# Altium schematic sheet Converter.SchDoc
size Tabloid
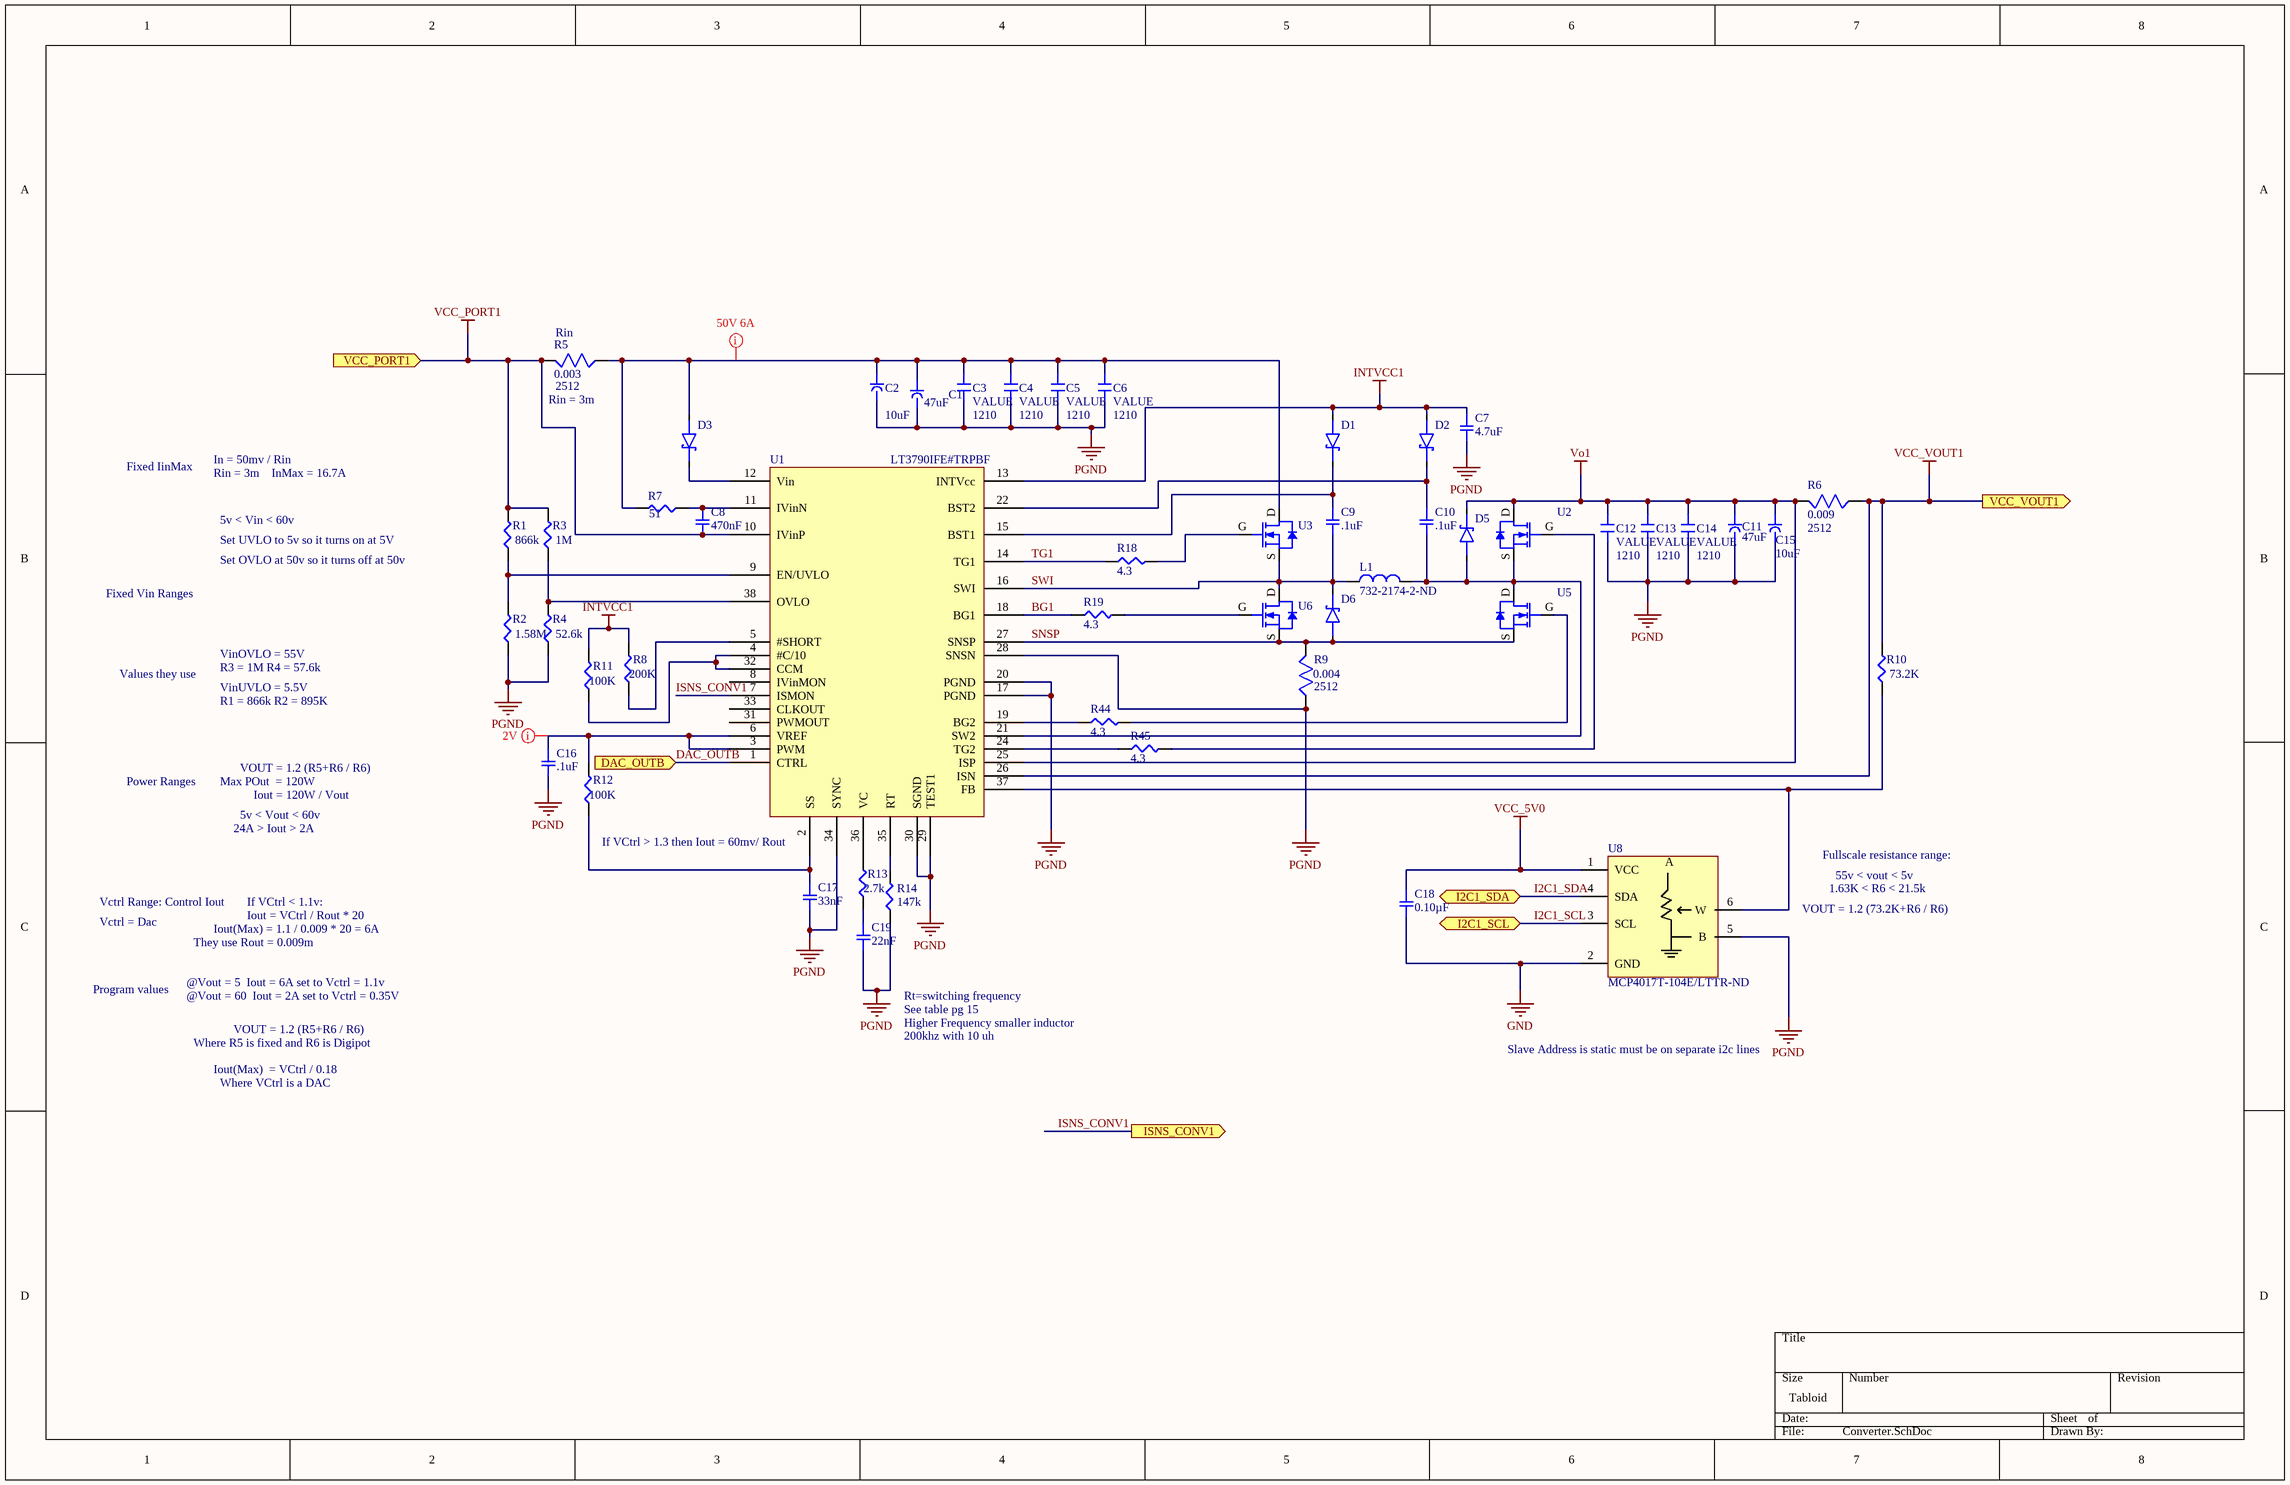
[diagram p0: Converter.SchDoc]

## Parts
C1  10-EEE-FN1K470UVTR-ND  [EEE-FN1K470UV]  (value not drawn)
C2  value 10uF  [panasonic d8]  (hidden comment: EEE-FN1K100XL)
C3  VALUE  Size: 1210  [1210 cap]
C4  VALUE  Size: 1210  [1210 cap]
C5  VALUE  Size: 1210  [1210 cap]
C6  VALUE  Size: 1210  [1210 cap]
C7  4.7uF  [SMD-0603C]
C8  470nF  [SMD-0603C]
C9  .1uF  [SMD-0603C]
C10  .1uF  [SMD-0603C]
C11  10-EEE-FN1K470UVTR-ND  [EEE-FN1K470UV]  (value not drawn)
C12  VALUE  Size: 1210  [1210 cap]
C13  VALUE  Size: 1210  [1210 cap]
C14  VALUE  Size: 1210  [1210 cap]
C15  value 10uF  [panasonic d8]  (hidden comment: EEE-FN1K100XL)
C16  .1uF  [SMD-0603C]
C17  33nF  [SMD-0603C]
C18  0.10µF  [SMD-0603C]
C19  22nF  [SMD-0603C]
D1  BAT46WJ,115  [SOD323F]  (value not drawn)
D2  BAT46WJ,115  [SOD323F]  (value not drawn)
D3  SK58L-TPMSTR-ND  [SMC(DO-214AB)]  (value not drawn)
D5  SK58L-TPMSTR-ND  [SMC(DO-214AB)]  (value not drawn)
D6  SK58L-TPMSTR-ND  [SMC(DO-214AB)]  (value not drawn)
L1  732-2174-2-ND  [Inductor]
R1  866k  [SMD-0603-RES]
R2  1.58M  [SMD-0603-RES]
R3  1M  [SMD-0603-RES]
R4  52.6k  [SMD-0603-RES]
R5  0.003  [2512]
R6  0.009  [2512]
R7  51  [SMD-0603-RES]
R8  200K  [SMD-0603-RES]
R9  0.004  [2512]
R10  73.2K  [SMD-0603-RES]
R11  100K  [SMD-0603-RES]
R12  100K  [SMD-0603-RES]
R13  2.7k  [SMD-0603-RES]
R14  147k  [SMD-0603-RES]
R18  4.3  [SMD-0603-RES]
R19  4.3  [SMD-0603-RES]
R44  4.3  [SMD-0603-RES]
R45  4.3  [SMD-0603-RES]
U1  LT3790IFE#TRPBF  [TSSOP-38-GNDPAD]
U2  SQJA80EP-T1_GE3TR-ND  [PowerPAK® SO-8L SINGLE]  (value not drawn)
U3  SQJA80EP-T1_GE3TR-ND  [PowerPAK® SO-8L SINGLE]  (value not drawn)
U5  SQJA80EP-T1_GE3TR-ND  [PowerPAK® SO-8L SINGLE]  (value not drawn)
U6  SQJA80EP-T1_GE3TR-ND  [PowerPAK® SO-8L SINGLE]  (value not drawn)
U8  MCP4017T-104E/LTTR-ND  [SC70]

## Ports
DAC_OUTB (in), I2C1_SCL (bidir), I2C1_SDA (bidir), ISNS_CONV1 (out), VCC_PORT1 (in), VCC_VOUT1 (out)

## Nets
GND: C18.2 U8.2(GND)
INTVCC1: C7.1 D1.2 D2.2 R8.2 R11.2 U1.13(INTVcc)
PGND: C1.1 C2.2 C3.2 C4.2 C5.2 C6.2 C7.2 C11.1 C12.2 C13.2 C14.2 C15.2 C16.2 C17.2 C19.2 R2.1 R4.1 R9.1 R14.1 U1.17(PGND) U1.20(PGND) U1.28(SNSN) U1.29(TEST1) U1.30(SGND) U1.34(SYNC) U8.5(B)
VCC_5V0: C18.1 U8.1(VCC)
VCC_PORT1: C8.2 R1.2 R3.2 R5.2 U1.10(IVinP) ; port VCC_PORT1
VCC_VOUT1: R6.1 R10.2 U1.26(ISN) ; port VCC_VOUT1
Vo1: C11.2 C12.1 C13.1 C14.1 C15.1 D5.1 R6.2 U1.25(ISP) U2.D(DRAIN)
BG1: R19.1 U1.18(BG1)
DAC_OUTB: U1.1(CTRL) ; port DAC_OUTB
I2C1_SCL: U8.3(SCL) ; port I2C1_SCL
I2C1_SDA: U8.4(SDA) ; port I2C1_SDA
ISNS_CONV1: U1.7(ISMON) ; port ISNS_CONV1
SNSP: D6.2 R9.2 U1.27(SNSP) U5.S(SOURCE) U6.S(SOURCE)
SWI: C9.2 D6.1 L1.1 U1.16(SWI) U3.S(SOURCE) U6.D(DRAIN)
TG1: R18.1 U1.14(TG1)
NetC1_2: C1.2 C2.1 C3.1 C4.1 C5.1 C6.1 D3.2 R5.1 R7.2 U3.D(DRAIN)
NetC8_1: C8.1 R7.1 U1.11(IVinN)
NetC9_1: C9.1 D1.1 U1.15(BST1)
NetC10_1: C10.1 D2.1 U1.22(BST2)
NetC10_2: C10.2 D5.2 L1.2 U1.21(SW2) U2.S(SOURCE) U5.D(DRAIN)
NetC16_1: C16.1 R12.2 U1.3(PWM) U1.6(VREF)
NetC17_1: C17.1 R12.1 U1.2(SS)
NetC19_1: C19.1 R13.1
NetD3_1: D3.1 U1.12(Vin)
NetR1_1: R1.1 R2.2 U1.9(EN/UVLO)
NetR3_1: R3.1 R4.2 U1.38(OVLO)
NetR8_1: R8.1 U1.5(#SHORT)
NetR10_1: R10.1 U1.37(FB) U8.6(W)
NetR11_1: R11.1 U1.4(#C/10) U1.32(CCM)
NetR13_2: R13.2 U1.36(VC)
NetR14_2: R14.2 U1.35(RT)
NetR18_2: R18.2 U3.G(GATE)
NetR19_2: R19.2 U6.G(GATE)
NetR44_1: R44.1 U1.19(BG2)
NetR44_2: R44.2 U5.G(GATE)
NetR45_1: R45.1 U1.24(TG2)
NetR45_2: R45.2 U2.G(GATE)

Not connected (* = marked no-connect by the designer): U1 8(IVinMON) 31(PWMOUT) 33(CLKOUT)

## Layout directives
mark named 2V: NetC16_1
mark named 50V 6A: NetC1_2

## Notes on the sheet
- (near R5) Rin
- (near R5) Rin = 3m
- Fixed IinMax
- Rin = 3m    InMax = 16.7A
- In = 50mv / Rin
- Set UVLO to 5v so it turns on at 5V
- Set OVLO at 50v so it turns off at 50v
- 5v < Vin < 60v
- Fixed Vin Ranges
- Values they use
- VinOVLO = 55V
- R3 = 1M R4 = 57.6k
- VinUVLO = 5.5V
- R1 = 866k R2 = 895K
- Power Ranges
- Max POut  = 120W
- 24A > Iout > 2A
- 5v < Vout < 60v
- VOUT = 1.2 (R5+R6 / R6)
- Iout = 120W / Vout
- If VCtrl > 1.3 then Iout = 60mv/ Rout
- Fullscale resistance range:
- 1.63K < R6 < 21.5k
- 55v < vout < 5v
- Vctrl Range: Control Iout
- Vctrl = Dac
- They use Rout = 0.009m
- Iout(Max) = 1.1 / 0.009 * 20 = 6A
- If VCtrl < 1.1v:
- Iout = VCtrl / Rout * 20
- VOUT = 1.2 (73.2K+R6 / R6)
- Program values
- @Vout = 5  Iout = 6A set to Vctrl = 1.1v
- @Vout = 60  Iout = 2A set to Vctrl = 0.35V
- Rt=switching frequency
- See table pg 15
- Higher Frequency smaller inductor
- Where R5 is fixed and R6 is Digipot
- Iout(Max)  = VCtrl / 0.18
- Where VCtrl is a DAC
- 200khz with 10 uh
- Slave Address is static must be on separate i2c lines
- (in symbol CAP ALUM 47UF) 47uF
- (in symbol IC DIGIPOT MCP4017T-104E/LT) A

## Library data of the parts
C1 C11 = CAP ALUM 47UF: CAP ALUM 47UF 20% 80V SMD
C2 C15 = CAP ALUM 10UF: CAP ALUM 10UF 20% 80V SMD
C3-C6 C12-C14 = CAP SMD 1210
C7-C10 C16 C17 C19 = GCJ188R71H472KA01D: 0603; Manufacturer: Murata Electronics North America; Factory Stock: 0; Unit Price (USD): 0.19; Minimum Quantity: 1; Value: 4700pF; Tolerance: ±10%; Voltage: 50V; Temperature Coefficient: X7R; Datasheets: http://www.murata.com/~/media/webrenewal/support/library/catalog/products/capacitor/mlcc/c03e.ashx; Image: //media.digikey.com/Renders/Murata%20Renders/0603%28LQG18%29.jpg; Digi-Key Part Number: 490-5764-1-ND; Part Number: GCJ188R71H472KA01D; Quantity Available: 7743; @ qty: 0; Packaging: Cut Tape (CT); Series: GCJ; Part Status: Active; Operating Temperature: -55°C ~ 125°C; Features: Soft Termination; Ratings: AEC-Q200; Applications: Automotive, Boardflex Sensitive; Mounting Type: Surface Mount, MLCC; Package / Case: 0603 (1608 Metric); Size / Dimension: 0.063" L x 0.031" W (1.60mm x 0.80mm); Height - Seated (Max): -; Thickness (Max): 0.031" (0.80mm); Lead Spacing: -; Lead Style: -
C18 = GCJ188R71H104KA12D: CAP CER 0.1UF 50V X7R 0603; Manufacturer: Murata Electronics North America; Factory Stock: 0; Unit Price (USD): 0.12; Minimum Quantity: 1; Tolerance: ±10%; Datasheets: http://www.murata.com/~/media/webrenewal/support/library/catalog/products/capacitor/mlcc/c03e.ashx; Image: //media.digikey.com/Renders/Murata%20Renders/0603%28LQG18%29.jpg; Digi-Key Part Number: 490-5798-1-ND; Part Number: GCJ188R71H104KA12D; Quantity Available: 163695; @ qty: 0; Packaging: Cut Tape (CT); Series: GCJ; Part Status: Active; Value: 0.10µF; Voltage: 50V; Temperature Coefficient: X7R; Operating Temperature: -55°C ~ 125°C; Features: Soft Termination; Ratings: AEC-Q200; Applications: Automotive, Boardflex Sensitive; Mounting Type: Surface Mount, MLCC; Package / Case: 0603 (1608 Metric); Size / Dimension: 0.063" L x 0.031" W (1.60mm x 0.80mm); Height - Seated (Max): -; Thickness (Max): 0.035" (0.90mm); Lead Spacing: -; Lead Style: -
D1 D2 = BAT46WJ,115: DIODE SCHOTTKY 100V 250MA SOD323 / Diode Schottky 100 V 250mA (DC) Surface Mount SOD-323F; Mfr_Name: Nexperia; Type: DEV; Copyright: Copyright (C) 2021 Ultra Librarian. All rights reserved.; Manufacturer_Part_Number: BAT46WJ,115; Digi-Key_Part_Number_1: 1727-4817-2-ND; Digi-Key_Part_Number_2: 1727-4817-1-ND; Digi-Key_Part_Number_3: 1727-4817-6-ND; RefDes: RefDes
D3 D5 D6 = DIODE SK58L-TP: DIODE SCHOTTKY 80V 5A DO214AB/SMC / Diode Schottky 80 V 5A Surface Mount SMC (DO-214AB)
L1 = INDUCTOR 7443556680: FIXED IND 6.8UH 18.5A 4.1MOHM SM
R1-R4 R7 R8 R10-R14 = ERJ-3BQJ5R6V: 0603; Manufacturer: Panasonic Electronic Components; Factory Stock: 0; Unit Price (USD): 0.03980; @ qty: 1500; Minimum Quantity: 1; Value: 5.6; Tolerance: ±5%; Power (Watts): 0.25W, 1/4W; Temperature Coefficient: ±200ppm/°C; Part Number: ERJ-3BQJ5R6V; Datasheets: https://industrial.panasonic.com/cdbs/www-data/pdf/RDA0000/AOA0000C239.pdf; Image: //media.digikey.com/Photos/Panasonic%20Photos/MFG_ERJ-P6W%20Series.jpg; Digi-Key Part Number: P17425CT-ND; Quantity Available: 3950; Packaging: Cut Tape (CT); Series: ERJ; Part Status: Active; Composition: Thick Film; Features: Automotive AEC-Q200, Current Sense; Operating Temperature: -55°C ~ 125°C; Package / Case: 0603 (1608 Metric); Supplier Device Package: 0603; Size / Dimension: 0.063" L x 0.031" W (1.60mm x 0.80mm); Height - Seated (Max): 0.022" (0.55mm); Number of Terminations: 2; Failure Rate: -
R5 R6 R9 = RES SMD 2512: RES SMD 2512 2W; Size: 2512
R18 R19 R44 R45 = ERJ-3BQF1R0V: RES SMD 1 OHM 1% 1/4W 0603; Manufacturer: Panasonic Electronic Components; Factory Stock: 0; Unit Price (USD): 0.05386; @ qty: 1500; Minimum Quantity: 1; Value: 1; Power (Watts): 0.25W, 1/4W; Temperature Coefficient: ±200ppm/°C; Part Number: ERJ-3BQF1R0V; Datasheets: https://industrial.panasonic.com/cdbs/www-data/pdf/RDA0000/AOA0000C239.pdf; Image: //media.digikey.com/Photos/Panasonic%20Photos/MFG_ERJ-P6W%20Series.jpg; Digi-Key Part Number: P17371CT-ND; Quantity Available: 30514; Packaging: Cut Tape (CT); Series: ERJ; Part Status: Active; Tolerance: ±1%; Composition: Thick Film; Features: Automotive AEC-Q200, Current Sense; Operating Temperature: -55°C ~ 125°C; Package / Case: 0603 (1608 Metric); Supplier Device Package: 0603; Size / Dimension: 0.063" L x 0.031" W (1.60mm x 0.80mm); Height - Seated (Max): 0.022" (0.55mm); Number of Terminations: 2; Failure Rate: -
U1 = IC LT3790 BUCK/BOOST 60V 150W: IC REG CTRLR BUCK-BOOST 38TSSOP / Buck-Boost Regulator Positive Output Step-Up/Step-Down - DC-DC Controller IC 38-TSSOP-EP
U2 U3 U5 U6 = FET SQJA80EP-T1_GE3: MOSFET N-CH 80V 60A PPAK SO-8
U8 = IC DIGIPOT MCP4017T-104E/LT: IC DGT POT 100KOHM 128TAP SC70-6